# EAGLE schematic carcomputer_split3_bottom1 (EAGLE 9.3.2)
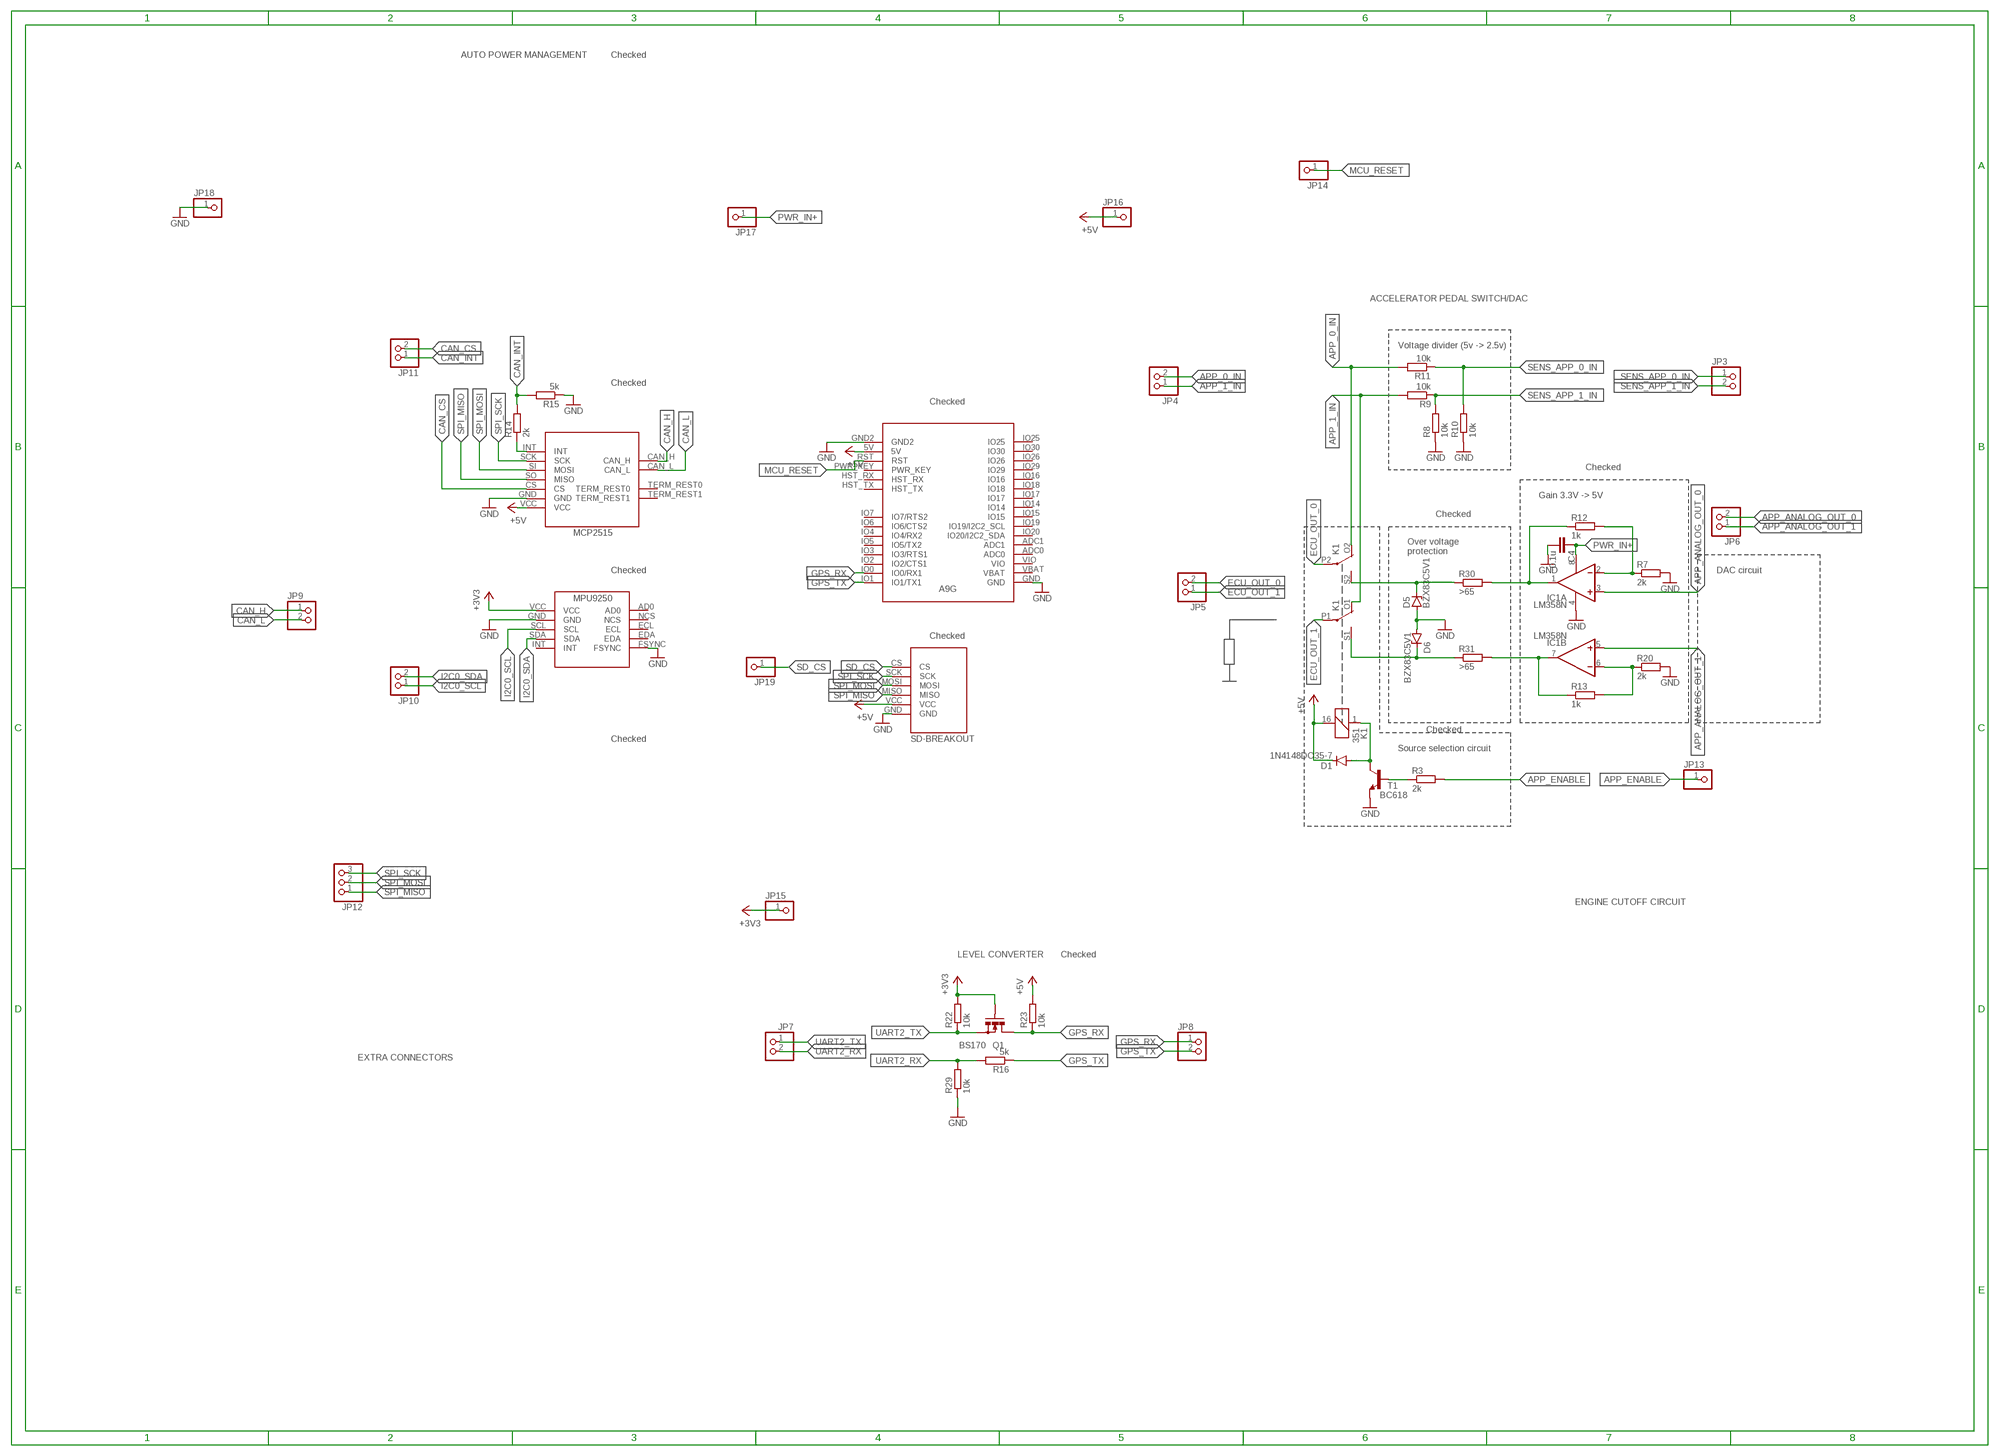
[diagram p0: schematic, sheet 1]

## Parts
C4  0.1u  C-EU025-050X050  [C025-050X050]
D1  1N4148DO35-7  [DO35-7]
D5  BZX83C5V1  BZX85  [DO41Z10]
D6  BZX83C5V1  BZX85  [DO41Z10]
IC1  LM358N  [DIL08]
JP3  PINHD-1X2  [1X02]
JP4  PINHD-1X2  [1X02]
JP5  PINHD-1X2  [1X02]
JP6  PINHD-1X2  [1X02]
JP7  PINHD-1X2  [1X02]
JP8  PINHD-1X2  [1X02]
JP9  PINHD-1X2  [1X02]
JP10  PINHD-1X2  [1X02]
JP11  PINHD-1X2  [1X02]
JP12  PINHD-1X3  [1X03]
JP13  PINHD-1X1  [1X01]
JP14  PINHD-1X1  [1X01]
JP15  PINHD-1X1  [1X01]
JP16  PINHD-1X1  [1X01]
JP17  PINHD-1X1  [1X01]
JP18  PINHD-1X1  [1X01]
JP19  PINHD-1X1  [1X01]
K1  351  [351]
Q1  BS170  [SOT54E]
R3  2k  R-EU_0207/7  [0207/7]
R7  2k  R-EU_0207/7  [0207/7]
R8  10k  R-EU_0207/7  [0207/7]
R9  10k  R-EU_0207/7  [0207/7]
R10  10k  R-EU_0207/7  [0207/7]
R11  10k  R-EU_0207/7  [0207/7]
R12  1k  R-EU_0207/7  [0207/7]
R13  1k  R-EU_0207/7  [0207/7]
R14  2k  R-EU_0207/7  [0207/7]
R15  5k  R-EU_0207/7  [0207/7]
R16  5k  R-EU_0207/7  [0207/7]
R20  2k  R-EU_0207/7  [0207/7]
R22  10k  R-EU_0207/7  [0207/7]
R23  10k  R-EU_0207/7  [0207/7]
R29  10k  R-EU_0207/7  [0207/7]
R30  >65  R-EU_0207/7  [0207/7]
R31  >65  R-EU_0207/7  [0207/7]
T1  BC618  [TO92-EBC]
U$2  MCP2515_DEVBOARDINVERTED  [MCP2515_DEVBOARD_INVERTED]
U$3  MPU9250_BREAKOUT  [MPU9250_BREAKOUT]
U$5  HKD-MICRO-SD-BREAKOUT  [HKD-MICRO-SD-BREAKOUT]
U$6  A9G  [A9G]

## Nets
+3V3: JP15.1 Q1.G R22.2 U$3.VCC
+5V: D1.C JP16.1 K1.16 R23.2 U$2.VCC U$5.VCC U$6.5V
APP_0_IN: JP4.2 K1.O2(3:O) R11.2
APP_1_IN: JP4.1 K1.O1(2:O) R9.2
APP_ANALOG_OUT_0: IC1.3(A:+IN) JP6.2
APP_ANALOG_OUT_1: IC1.5(B:+IN) JP6.1
APP_ENABLE: JP13.1 R3.2
CAN_CS: JP11.2 U$2.CS
CAN_H: JP9.1 U$2.CAN_H
CAN_INT: JP11.1 R14.2 R15.2
CAN_L: JP9.2 U$2.CAN_L
ECU_OUT_0: JP5.2 K1.P2(3:P)
ECU_OUT_1: JP5.1 K1.P1(2:P)
GND: C4.2 D5.A D6.A IC1.4(P:V-) JP18.1 R7.2 R8.1 R10.1 R15.1 R20.2 R29.1 T1.E U$2.GND U$3.FSYNC U$3.GND U$5.GND U$6.GND U$6.GND2
GPS_RX: JP8.1 Q1.D R23.1 U$6.IO0(IO0/RX1)
GPS_TX: JP8.2 R16.1 U$6.IO1(IO1/TX1)
I2C0_SCL: JP10.1 U$3.SCL
I2C0_SDA: JP10.2 U$3.SDA
MCU_RESET: JP14.1 U$6.RST
N$1: D1.A K1.1 T1.C
N$2: R3.1 T1.B
N$3: D6.C K1.S1(2:S) R31.1
N$4: IC1.1(A:OUT) R12.1 R30.2
N$10: R14.1 U$2.INT
N$13: IC1.2(A:-IN) R7.1 R12.2
N$16: IC1.6(B:-IN) R13.2 R20.1
N$17: D5.C K1.S2(3:S) R30.1
N$18: IC1.7(B:OUT) R13.1 R31.2
PWR_IN+: C4.1 IC1.8(P:V+) JP17.1
SD_CS: JP19.1 U$5.CS
SENS_APP_0_IN: JP3.1 R10.2 R11.1
SENS_APP_1_IN: JP3.2 R8.2 R9.1
SPI_MISO: JP12.1 U$2.SO(MISO) U$5.MISO
SPI_MOSI: JP12.2 U$2.SI(MOSI) U$5.MOSI
SPI_SCK: JP12.3 U$2.SCK U$5.SCK
UART2_RX: JP7.2 R16.2 R29.2
UART2_TX: JP7.1 Q1.S R22.1
Unconnected: U$2.TERM_REST0 U$2.TERM_REST1 U$3.AD0 U$3.ECL U$3.EDA U$3.INT U$3.NCS U$6.ADC0 U$6.ADC1 U$6.HST_RX U$6.HST_TX U$6.IO2(IO2/CTS1) U$6.IO3(IO3/RTS1) U$6.IO4(IO4/RX2) U$6.IO5(IO5/TX2) U$6.IO6(IO6/CTS2) U$6.IO7(IO7/RTS2) U$6.IO14 U$6.IO15 U$6.IO16 U$6.IO17 U$6.IO18 U$6.IO19(IO19/I2C2_SCL) U$6.IO20(IO20/I2C2_SDA) U$6.IO25 U$6.IO26 U$6.IO29 U$6.IO30 U$6.PWR_KEY U$6.VBAT U$6.VIO

## Notes on the sheet
- AUTO POWER MANAGEMENT | Checked
- ACCELERATOR PEDAL SWITCH/DAC
- Voltage divider (5v -> 2.5v)
- Checked
- Checked
- Checked
- Gain 3.3V -> 5V
- Checked
- Over voltage
  protection
- Checked | DAC circuit
- Checked
- Checked
- Checked
- Source selection circuit
- ENGINE CUTOFF CIRCUIT
- LEVEL CONVERTER | Checked
- EXTRA CONNECTORS

## Library data of the parts
C4 = rcl:C-EU: CAPACITOR, European symbol; SPICEPREFIX: C
D1 = diode:1N4148: DIODE high speed (Philips)
D5 D6 = diode:BZX85: Z DIODE
IC1 = linear:LM358: OP AMP also LM158; LM258; LM2904 Source: http://cache.national.com/ds/LM/LM158.pdf
JP3-JP11 = pinhead:PINHD-1X2: PIN HEADER
JP12 = pinhead:PINHD-1X3: PIN HEADER
JP13-JP19 = pinhead:PINHD-1X1: PIN HEADER
K1 = relay:351: RELAY 2 x switch, Omron; OC_FARNELL: unknown; OC_NEWARK: unknown
Q1 = transistor-small-signal:BS170: N-CHANNEL MOS FET
R3 R7-R16 R20 R22 R23 R29-R31 = rcl:R-EU_: RESISTOR, European symbol; SPICEPREFIX: R
T1 = transistor-npn:BC618*: NPN Transistor
U$2 = MCP2515:MCP2515_DEVBOARD
U$3 = MPU9250:MPU9250_BREAKOUT
U$5 = sd-mmc:HKD-MICRO-SD-BREAKOUT
U$6 = A9:A9G